# Altium schematic sheet M_FOC.SchDoc
size A4
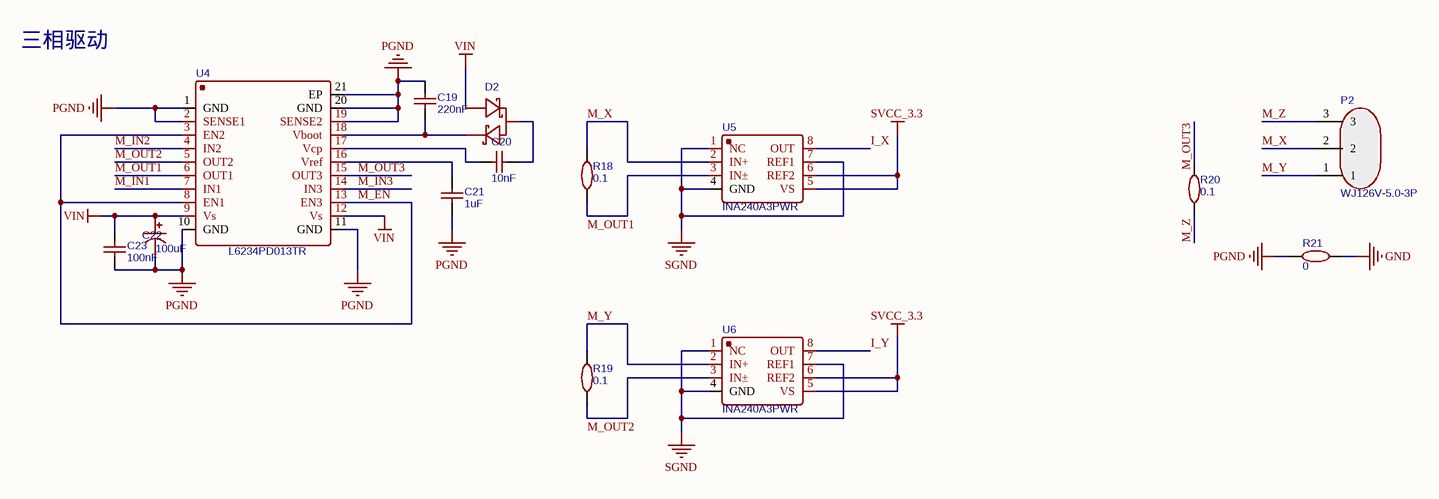
[diagram p0: M_FOC.SchDoc]

## Parts
C19  220nF  [C0603]
C20  10nF  [C0603]
C21  1uF  [C0603]
C22  100uF  [CAP-SMD_BD6.3-L6.6-W6.6-RD]
C23  100nF  [C0603]
D2  BAT54S_C916425  [SOT-23-3_L2.9-W1.3-P1.90-LS2.4-BR]  (value not drawn)
P2  WJ126V-5.0-3P  [CONN-TH_3P-P5.00_WJ126V-5.0-3P]
R18  0.1  [R2010]
R19  0.1  [R2010]
R20  0.1  [R2010]
R21  0  [R0603]
U4  L6234PD013TR  [POWERSO20_L15.9-W11.0-P1.27-LS14.2-BL-EP]
U5  INA240A3PWR  [TSSOP-8_L4.4-W3.0-P0.65-LS6.4-BL-2]
U6  INA240A3PWR  [TSSOP-8_L4.4-W3.0-P0.65-LS6.4-BL-2]

## Nets
GND: R21.2
PGND: C19.2 C21.1 C22.2 C23.1 R21.1 U4.1(GND) U4.2(SENSE1) U4.10(GND) U4.11(GND) U4.19(SENSE2) U4.20(GND) U4.21(EP)
SGND: U5.1(NC) U5.4(GND) U5.7(REF1) U6.1(NC) U6.4(GND) U6.7(REF1)
SVCC_3.3: U5.5(VS) U5.6(REF2) U6.5(VS) U6.6(REF2)
VIN: C22.1 C23.2 D2.1(A) U4.9(Vs) U4.12(Vs)
I_X: U5.8(OUT)
I_Y: U6.8(OUT)
M_EN: U4.3(EN2) U4.8(EN1) U4.13(EN3)
M_IN1: U4.7(IN1)
M_IN2: U4.4(IN2)
M_IN3: U4.14(IN3)
M_OUT1: R18.1 U4.6(OUT1) U5.3(IN±)
M_OUT2: R19.1 U4.5(OUT2) U6.3(IN±)
M_OUT3: R20.2 U4.15(OUT3)
M_X: P2.2 R18.2 U5.2(IN+)
M_Y: P2.1 R19.2 U6.2(IN+)
M_Z: P2.3 R20.1
NetC19_1: C19.1 D2.2(K) U4.18(Vboot)
NetC20_1: C20.1 U4.17(Vcp)
NetC20_2: C20.2 D2.3
NetC21_2: C21.2 U4.16(Vref)

## Notes on the sheet
- 三相驱动

## Library data of the parts
C19 = 220nF: BOM_Manufacturer: YAGEO; BOM_Manufacturer Part: CC0805KRX7R9BB104; nameAlias: Capacitance; BOM_Supplier: LCSC; BOM_Supplier Part: C49678; BOM_JLCPCB Part Class: Basic Part; spicePre: C; spiceSymbolName: CC0805KRX7R9BB104
C20 = 10nF: BOM_Manufacturer: YAGEO; BOM_Manufacturer Part: CC0805KRX7R9BB104; nameAlias: Capacitance; BOM_Supplier: LCSC; BOM_Supplier Part: C49678; BOM_JLCPCB Part Class: Basic Part; spicePre: C; spiceSymbolName: CC0805KRX7R9BB104
C21 = 1uF: BOM_Manufacturer: YAGEO; BOM_Manufacturer Part: CC0805KRX7R9BB104; nameAlias: Capacitance; BOM_Supplier: LCSC; BOM_Supplier Part: C49678; BOM_JLCPCB Part Class: Basic Part; spicePre: C; spiceSymbolName: CC0805KRX7R9BB104
C22 = 100uF: 电解电容; BOM_Manufacturer: ROQANG; BOM_Manufacturer Part: RVE1V101M0607; nameAlias: Capacitance; BOM_Supplier: LCSC; BOM_Supplier Part: C99837; BOM_JLCPCB Part Class: Extended Part; spicePre: C; spiceSymbolName: RVE1V101M0607-C99837
C23 = 100nF: BOM_Manufacturer: YAGEO; BOM_Manufacturer Part: CC0805KRX7R9BB104; nameAlias: Capacitance; BOM_Supplier: LCSC; BOM_Supplier Part: C49678; BOM_JLCPCB Part Class: Basic Part; spicePre: C; spiceSymbolName: CC0805KRX7R9BB104
D2 = BAT54S: 肖特基; BOM_Manufacturer: JSMSEMI; Contributor: LCSC; BOM_Supplier: LCSC; BOM_Supplier Part: C916425; BOM_Manufacturer Part: BAT54S; BOM_JLCPCB Part Class: Extended Part; spicePre: D; spiceSymbolName: BAT54S_C916425
P2 = WJ126V-5.0-3P: BOM_Manufacturer: ReliaPro; BOM_Supplier: LCSC; BOM_Manufacturer Part: WJ126V-5.0-3P; BOM_Supplier Part: C8401; BOM_JLCPCB Part Class: Extended Part; spicePre: P; spiceSymbolName: WJ126V-5.0-3P
R18-R20 = 0.1: BOM_Manufacturer: UniOhm; BOM_Manufacturer Part: 0805W8F1002T5E; nameAlias: Resistance (Ohms); BOM_Supplier: LCSC; BOM_Supplier Part: C17414; BOM_JLCPCB Part Class: Basic Part; spicePre: R; spiceSymbolName: 0805W8F1002T5E
R21 = 0: 0欧电阻; BOM_Manufacturer: UniOhm; BOM_Manufacturer Part: 0805W8F1002T5E; nameAlias: Resistance (Ohms); BOM_Supplier: LCSC; BOM_Supplier Part: C17414; BOM_JLCPCB Part Class: Basic Part; spicePre: R; spiceSymbolName: 0805W8F1002T5E
U4 = L6234PD013TR: 三路H桥; BOM_Manufacturer: STMicroelectronics; BOM_Supplier: LCSC; BOM_Manufacturer Part: L6234PD013TR; BOM_Supplier Part: C77581; BOM_JLCPCB Part Class: Extended Part; spicePre: U; spiceSymbolName: L6234PD013TR
U5 U6 = INA240A3PWR: BOM_Manufacturer: TI(德州仪器); Contributor: LCSC; BOM_Supplier: LCSC; BOM_Supplier Part: C544538; BOM_Manufacturer Part: INA240A3PWR; BOM_JLCPCB Part Class: Extended Part; spicePre: U; spiceSymbolName: INA240A3PWR